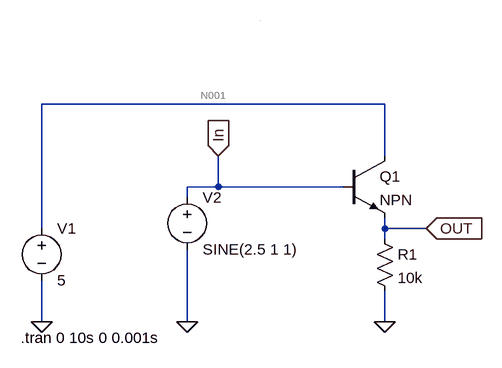
[diagram p0: schematic schemat.asc]
schemat.asc, the LTspice schematic file:
Version 4
SHEET 1 880 680
WIRE 192 128 -336 128
WIRE 192 208 192 128
WIRE -64 256 -64 208
WIRE -64 256 -112 256
WIRE 128 256 -64 256
WIRE -112 272 -112 256
WIRE -336 320 -336 128
WIRE 192 320 192 304
WIRE 256 320 192 320
WIRE 192 336 192 320
WIRE -336 464 -336 400
WIRE -112 464 -112 352
WIRE 192 464 192 416
WIRE 0 0 0 0
FLAG 256 320 OUT
IOPIN 256 320 In
FLAG -336 464 0
FLAG 192 464 0
FLAG -112 464 0
FLAG -64 208 In
IOPIN -64 208 In
SYMBOL voltage -336 304 R0
WINDOW 123 0 0 Left 0
WINDOW 39 0 0 Left 0
SYMATTR InstName V1
SYMATTR Value 5
SYMBOL npn 128 208 R0
SYMATTR InstName Q1
SYMBOL res 176 320 R0
SYMATTR InstName R1
SYMATTR Value 10k
SYMBOL voltage -112 256 R0
WINDOW 123 0 0 Left 0
WINDOW 39 0 0 Left 0
SYMATTR InstName V2
SYMATTR Value SINE(2.5 1 1)
TEXT -368 488 Left 2 !.tran 0 10s 0 0.001s

The netlist it stands for:
* schemat.asc
V1 N001 0 5
Q1 N001 In OUT 0 NPN
R1 OUT 0 10k
V2 In 0 SINE(2.5 1 1)
.model NPN NPN
.model PNP PNP
.lib standard.bjt
.tran 0 10s 0 0.001s
.backanno
.end

* Results of the author's LTspice run, read from the files saved beside the schematic
* Operating Point, zero values left out:
*   V(n001) = 5 V
*   V(in) = 2.5 V
*   V(out) = 1.771 V
*   Ic(Q1) = 175.3 µA
*   Ib(Q1) = 1.753 µA
*   Ie(Q1) = -177.1 µA
*   I(R1) = 177.1 µA
*   I(V1) = -175.3 µA
*   I(V2) = -1.753 µA
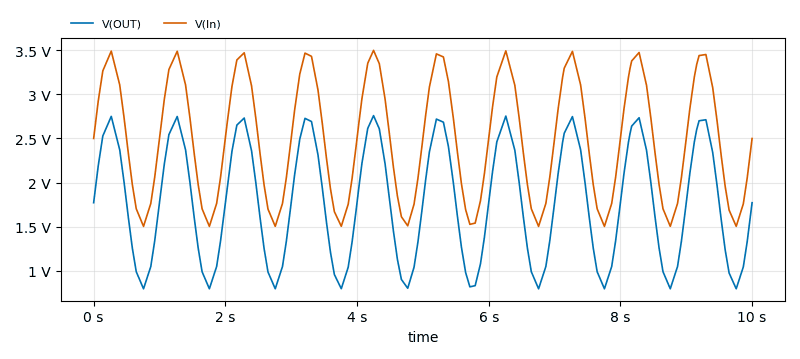
[diagram p1: Transient Analysis of schemat.asc, plotted from the saved traces]
* Transient Analysis, 1 run:
*   V(OUT): min 793.9 mV, max 2.759 V, average 1.771 V, rms 1.898 V, last 1.771 V
*   V(In): min 1.502 V, max 3.5 V, average 2.498 V, rms 2.593 V, last 2.5 V